# EAGLE design srr_board (EAGLE 6.2)
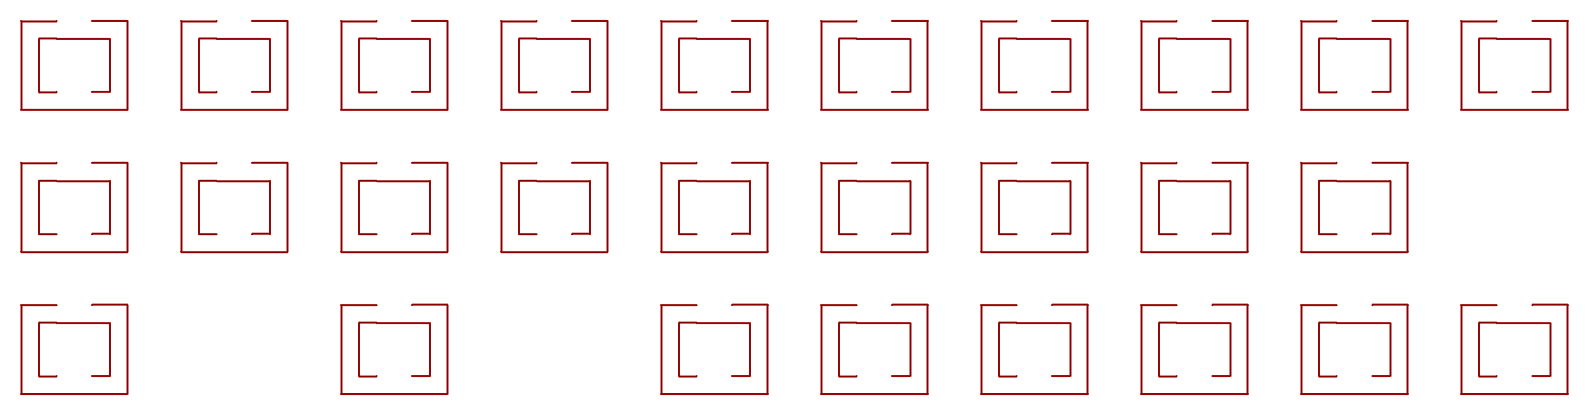
[diagram p0: schematic, sheet 1]

## Parts
U$1  SRR  [SRR]
U$2  SRR  [SRR]
U$3  SRR  [SRR]
U$4  SRR  [SRR]
U$5  SRR  [SRR]
U$7  SRR  [SRR]
U$8  SRR  [SRR]
U$9  SRR  [SRR]
U$10  SRR  [SRR]
U$11  SRR  [SRR]
U$13  SRR  [SRR]
U$14  SRR  [SRR]
U$15  SRR  [SRR]
U$16  SRR  [SRR]
U$17  SRR  [SRR]
U$19  SRR  [SRR]
U$20  SRR  [SRR]
U$21  SRR  [SRR]
U$22  SRR  [SRR]
U$23  SRR  [SRR]
U$24  SRR  [SRR]
U$25  SRR  [SRR]
U$26  SRR  [SRR]
U$27  SRR  [SRR]
U$28  SRR  [SRR]
U$29  SRR  [SRR]
U$30  SRR  [SRR]

## Library data of the parts
U$1-U$5 U$7-U$11 U$13-U$17 U$19-U$30 = metamaterials:SRR

## Board
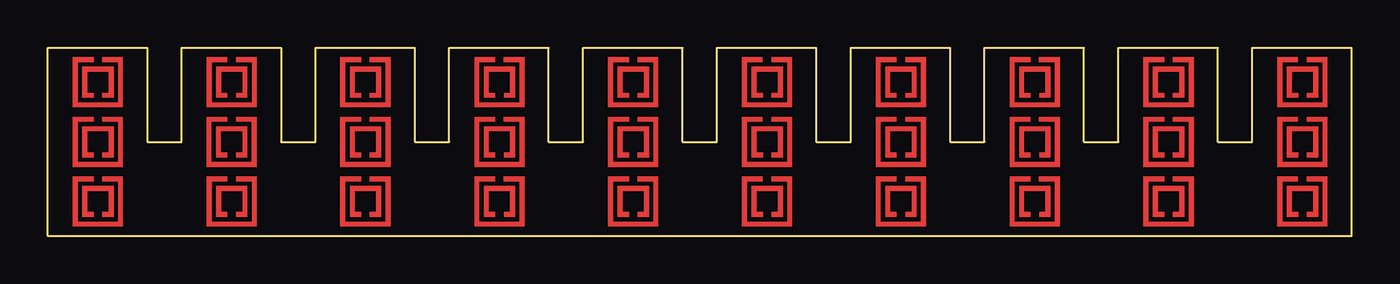
[diagram p1: board, top side]
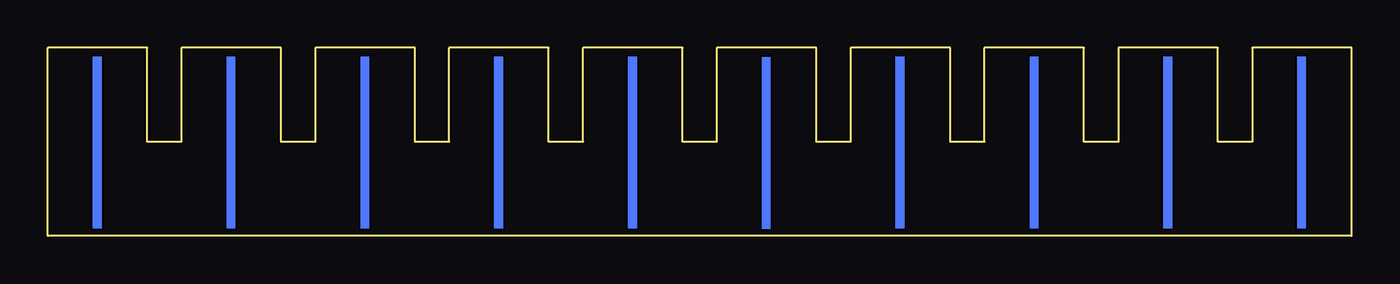
[diagram p2: board, bottom side, seen from below]

Size 68.2 x 9.86 mm. Coordinates in mm from the lower left corner, seen from the top.
Outline: 0,0 0,9.86 5.2,9.86 5.2,4.93 7,4.93 7,9.86 12.2,9.86 12.2,4.93 14,4.93 14,9.86 19.2,9.86 19.2,4.93 21,4.93 21,9.86 26.2,9.86 26.2,4.93 28,4.93 28,9.86 33.2,9.86 33.2,4.93 35,4.93 35,9.86 40.2,9.86 40.2,4.93 42,4.93 42,9.86 47.2,9.86 47.2,4.93 49,4.93 49,9.86 54.2,9.86 54.2,4.93 56,4.93 56,9.86 61.2,9.86 61.2,4.93 63,4.93 63,9.86 68.2,9.86 68.2,0 0,0
Copper layers (1*16): Top 0.035mm / dielectric 1.5mm / Bottom 0.035mm
Design rules: minimum track width 10mil, minimum drill 24mil, track to track 8mil, track to pad 8mil, pad to pad 8mil, via to via 8mil, smd to smd 8mil, copper to edge 40mil, drill to drill 8mil, minimum pad ring 10mil, minimum via ring 8mil, stop-mask expansion 4mil, vias tented up to drill 0mil, thermal gap 10mil

### Placement (x,y rotation side)
U$1  57.31,3.62 0 top
U$2  43.31,6.74 0 top
U$3  36.31,6.74 0 top
U$4  22.31,3.62 0 top
U$5  8.31,0.5 0 top
U$6  SRR  [SRR]  1.31,0.5 0 top
U$7  57.31,6.74 0 top
U$8  50.31,0.5 0 top
U$9  36.31,3.62 0 top
U$10  22.31,6.74 0 top
U$11  15.3,0.5 0 top
U$12  SRR  [SRR]  1.31,3.62 0 top
U$13  64.31,0.5 0 top
U$14  50.31,3.62 0 top
U$15  36.31,0.5 0 top
U$16  29.31,0.5 0 top
U$17  15.3,3.62 0 top
U$18  SRR  [SRR]  1.31,6.74 0 top
U$19  64.31,3.62 0 top
U$20  57.31,0.5 0 top
U$21  43.31,0.5 0 top
U$22  29.31,3.62 0 top
U$23  15.3,6.74 0 top
U$24  8.3,3.62 0 top
U$25  64.31,6.74 0 top
U$26  50.31,6.74 0 top
U$27  43.31,3.62 0 top
U$28  29.31,6.74 0 top
U$29  22.31,0.5 0 top
U$30  8.31,6.74 0 top

### Tracks (layer width: path | path; a pad name or v marks a point on that pad's centre or on a via)
N$1  (via drill 0.6)
  other vias: -5.34,-2.06
(copper drawn outside any net)
  shapes: Bottom area x10